# Altium schematic sheet Power.SchDoc
size C
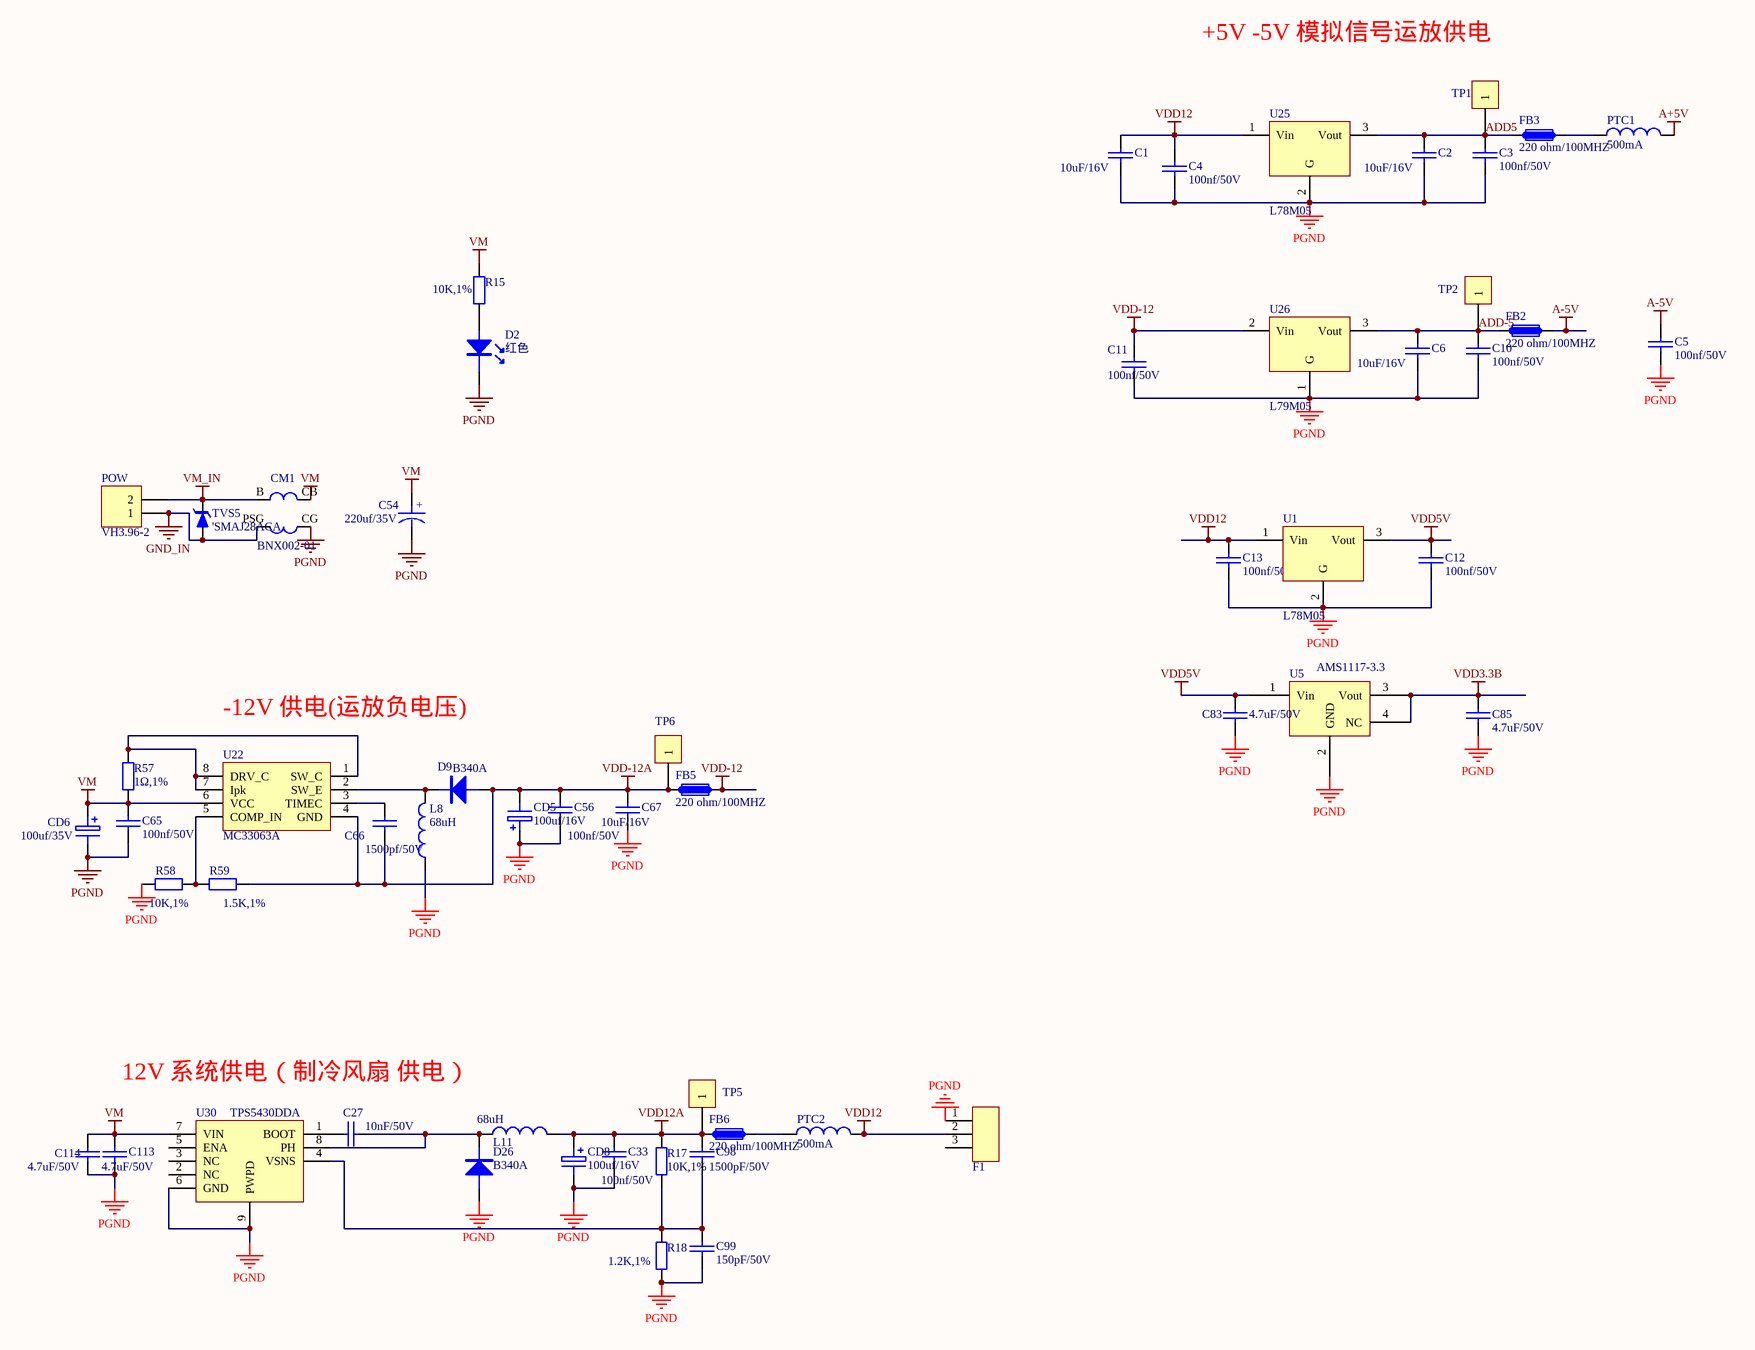
[diagram p0: Power.SchDoc]

## Parts
C1  10uF/16V  [1206]
C2  10uF/16V  [1206]
C3  100nf/50V  [0805]
C4  100nf/50V  [0805]
C5  100nf/50V  [0805]
C6  10uF/16V  [1206]
C10  100nf/50V  [0805]
C11  100nf/50V  [0805]
C12  100nf/50V  [0805]
C13  100nf/50V  [0805]
C27  10nF/50V  [0805]
C33  100nf/50V  [0805]
C54  220uf/35V  [CX8*10.5]
C56  100nf/50V  [0805]
C65  100nf/50V  [0805]
C66  1500pf/50V  [0805]
C67  10uF/16V  [1206]
C83  4.7uF/50V  [1206]
C85  4.7uF/50V  [1206]
C98  1500pF/50V  [0805]
C99  150pF/50V  [0805]
C113  4.7uF/50V  [1206]
C114  4.7uF/50V  [1206]
CD5  100uf/16V  [7343D]
CD6  100uf/35V  [CX6.3*5.4]
CD8  100uf/16V  [7343D]
CM1  BNX002-01  [BNX-002-01]
D2  value 红色  [LED_0805]  (hidden comment: LED,Red)
D9  B340A  [SMA]
D26  B340A  [SMA]
F1  KF2510-3P  [KF2510-3]  (value not drawn)
FB2  220 ohm/100MHZ  [0805]
FB3  220 ohm/100MHZ  [0805]
FB5  220 ohm/100MHZ  [0805]
FB6  220 ohm/100MHZ  [0805]
L8  68uH  [INDUCTOR 6*6]
L11  68uH  [INDUCTOR 6*6]
POW  VH3.96-2  [VH3.96-2]
PTC1  value 500mA  [1210]  (hidden comment: PTCC)
PTC2  value 500mA  [1210]  (hidden comment: PTCC)
R15  10K,1%  [0805]
R17  10K,1%  [0805]
R18  1.2K,1%  [0805]
R57  1Ω,1%  [2512]
R58  10K,1%  [0805]
R59  1.5K,1%  [0805]
TP1  TP  [TP1]  (value not drawn)
TP2  TP  [TP1]  (value not drawn)
TP5  TP  [TP1]  (value not drawn)
TP6  TP  [TP1]  (value not drawn)
TVS5  'SMAJ28ACA  [SMB]
U1  L78M05  [TO-252]
U5  AMS1117-3.3  [SOT223S]
U22  MC33063A  [SOIC8]
U25  L78M05  [TO-252]
U26  L79M05  [TO-252]
U30  TPS5430DDA  [S0IC8-DDA]

## Nets
A+5V: PTC1.2
A-5V: C5.1 FB2.2
GND_IN: CM1.PSG POW.1 TVS5.A
PGND: C1.2 C2.2 C3.2 C4.2 C5.2 C6.2 C10.2 C11.2 C12.2 C13.2 C33.2 C54.2 C56.2 C65.2 C67.2 C83.2 C85.2 C99.1 C113.2 C114.2 CD5.1 CD6.2 CD8.2 CM1.CG D2.K D26.A F1.1 L8.1 R18.1 R58.2 U1.2(G) U5.2(GND) U25.2(G) U26.1(G) U30.6(GND) U30.9(PWPD)
VDD3.3B: C85.1 U5.3(Vout) U5.4(NC)
VDD5V: C12.1 C83.1 U1.3(Vout) U5.1(Vin)
VDD12: C1.1 C4.1 C13.1 F1.2 PTC2.2 U1.1(Vin) U25.1(Vin)
VDD12A: C33.1 C98.2 CD8.1 FB6.1 L11.2 R17.2 TP5.1
VDD-12: C11.1 FB5.2 U26.2(Vin)
VDD-12A: C56.1 C66.2 C67.1 CD5.2 D9.A FB5.1 R59.1 TP6.1 U22.4(GND)
VM: C54.1 C65.1 C113.1 C114.1 CD6.1 CM1.CB R15.1 R57.2 U22.6(VCC) U30.7(VIN)
VM_IN: CM1.B POW.2 TVS5.K
ADD5: C2.1 C3.1 FB3.1 TP1.1 U25.3(Vout)
ADD-5: C6.1 C10.1 FB2.1 TP2.1 U26.3(Vout)
NetC27_1: C27.1 U30.1(BOOT)
NetC27_2: C27.2 D26.K L11.1 U30.8(PH)
NetC66_1: C66.1 U22.3(TIMEC)
NetC98_1: C98.1 C99.2 R17.1 R18.2 U30.4(VSNS)
NetD2_A: D2.A R15.2
NetD9_K: D9.K L8.2 U22.2(SW_E)
NetFB3_2: FB3.2 PTC1.1
NetFB6_2: FB6.2 PTC2.1
NetR57_1: R57.1 U22.1(SW_C) U22.7(Ipk) U22.8(DRV_C)
NetR58_1: R58.1 R59.2 U22.5(COMP_IN)

Not connected (* = marked no-connect by the designer): F1 3; U30 2(NC) 3(NC) 5(ENA)

## Notes on the sheet
- +5V -5V 模拟信号运放供电
- -12V 供电(运放负电压)
- 12V 系统供电（制冷风扇 供电）
- (in symbol CAPACITOR POL) +

## Library data of the parts
C1-C6 C10-C13 C27 C33 C56 C65-C67 C83 C85 C98 C99 C113 C114 = CAP: Capacitor
  C1 C2 C6: Value: 10uF/16V
  C27: Value: 10nF/50V
  C33 C56 C65: Value: 100nf/50V
  C66: Value: 1500pf/50V
  C83 C85 C113 C114: Value: 4.7uF/50V
  C98: Value: 1500pF/50V
  C99: Value: 150pF/50V
C54 = CAPACITOR POL: Capacitor
CD5 CD6 CD8 = Capacitor Electrolytic: Electrolytic Capacitor
CM1 = EMIFIL-BNX: inductor
D2 = LED
D9 D26 = DIODE
F1 = KF2510-3P: KF2510-2.54-3P 针座
FB2 FB3 FB5 FB6 = Ferrite Bead
L8 L11 = INDUCTOR
POW = VH-2: VH3.96 2P 插座; Revision: 17-Jul-2002: Re-released for DXP Platform.; Publisher: Altium Limited
R15 R17 R18 R57-R59 = Res2: Resistor; Published: 8-Jun-2000; Revision: July-2002: Re-released for DXP Platform.; Publisher: Altium Limited
TP1 TP2 TP5 TP6 = TP: Connector
TVS5 = TVS
U1 U25 = L78XX: L78XX系列芯片
U5 = LM1117-33
U26 = L79XX: L79XX系列芯片